# EAGLE design pc_ads1292r_shield_v2 (EAGLE 6.4)

## Sheet 1 of 2
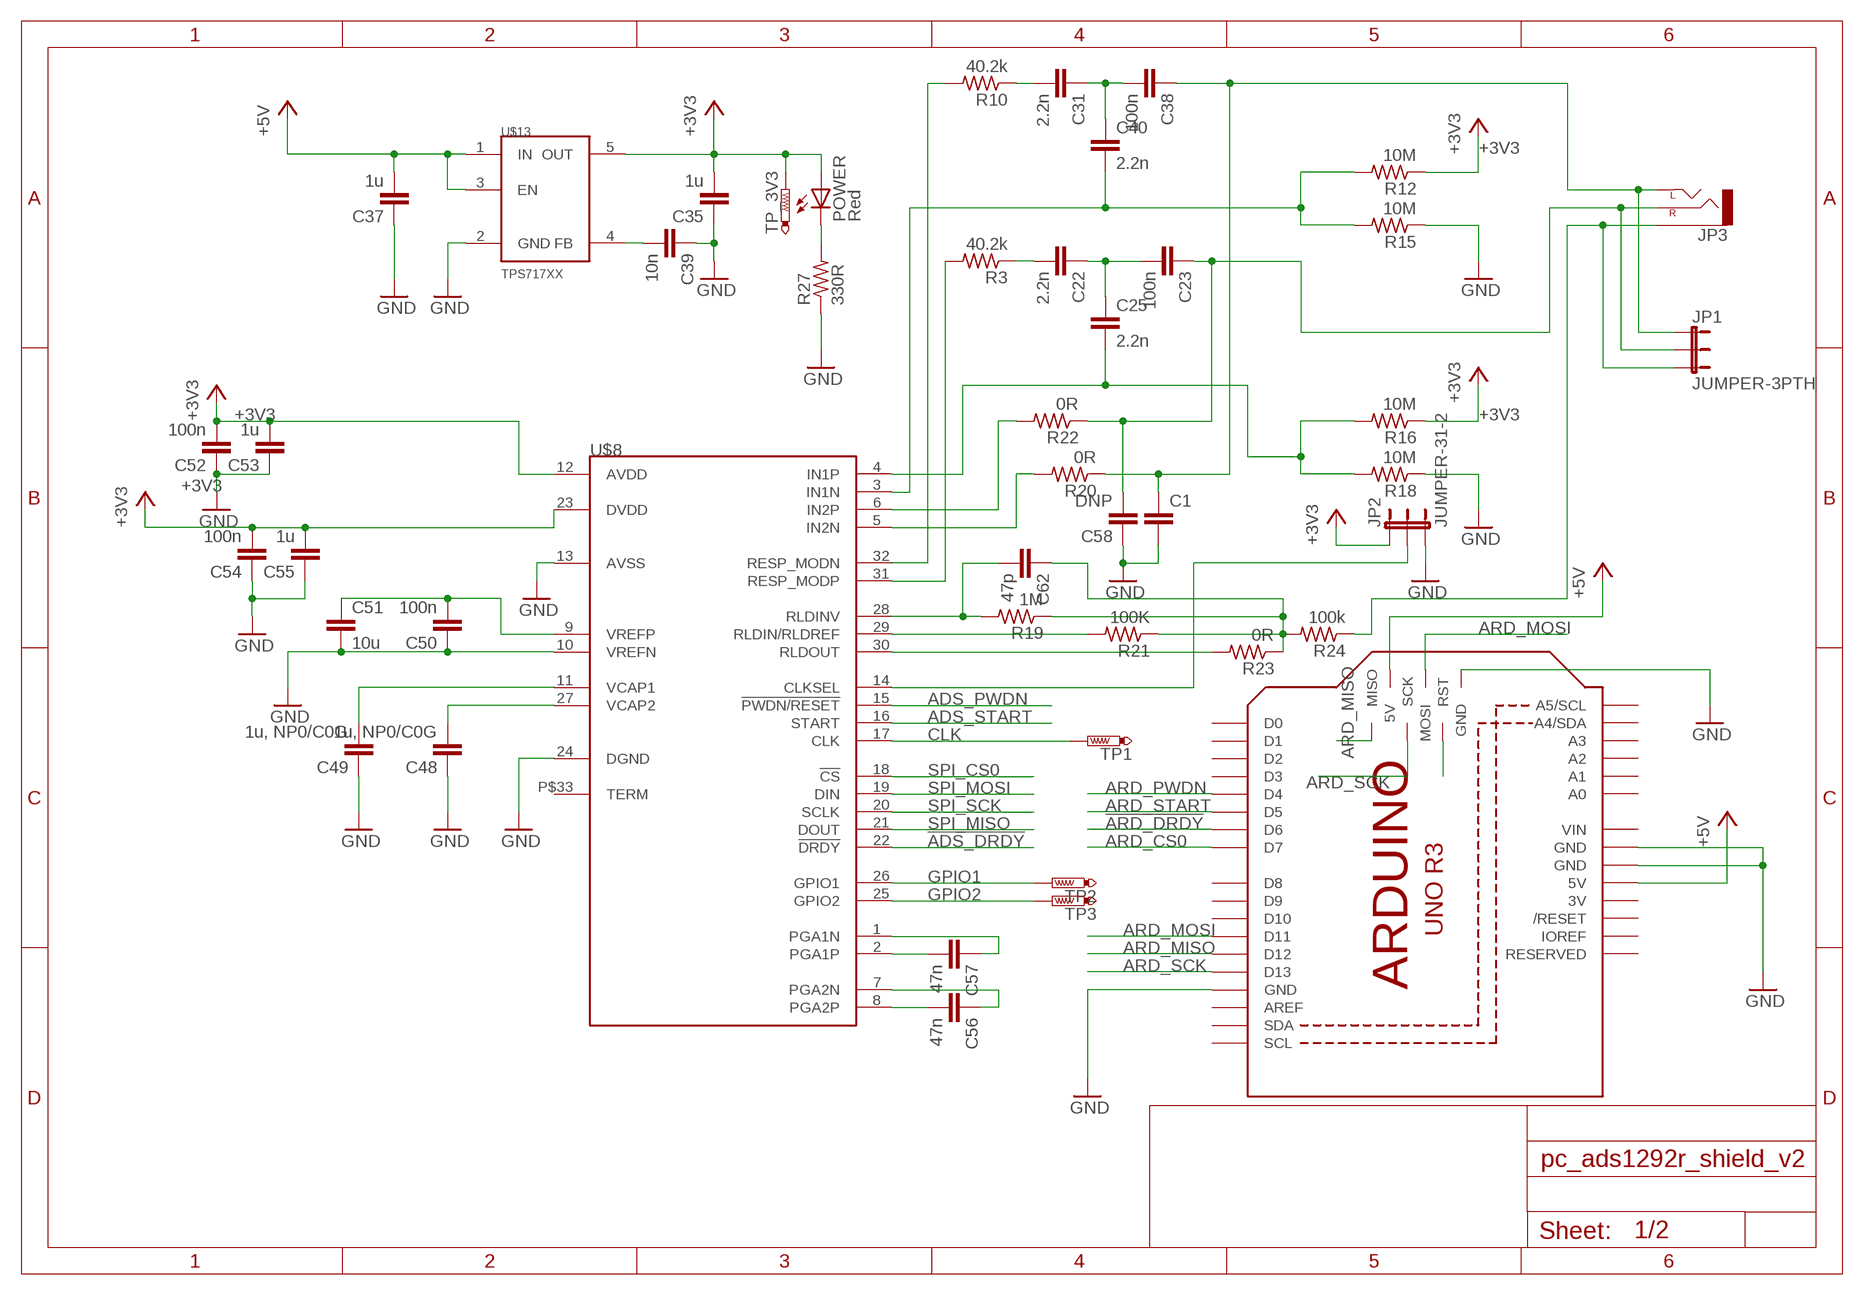
[diagram p0: schematic, sheet 1]

### Parts
C1  C-EUC0402  [C0402]
C22  2.2n  C-EUC0402  [C0402]
C23  100n  C-EUC0402  [C0402]
C25  2.2n  C-EUC0402  [C0402]
C31  2.2n  C-EUC0402  [C0402]
C35  1u  C-EUC0402  [C0402]
C37  1u  C-EUC0402  [C0402]
C38  100n  C-EUC0402  [C0402]
C39  10n  C-EUC0402  [C0402]
C40  2.2n  C-EUC0402  [C0402]
C48  1u, NP0/C0G  C-EUC0402  [C0402]
C49  1u, NP0/C0G  C-EUC0402  [C0402]
C50  100n  C-EUC0402  [C0402]
C51  10u  C-EUC0603  [C0603]
C52  100n  C-EUC0402  [C0402]
C53  1u  C-EUC0402  [C0402]
C54  100n  C-EUC0402  [C0402]
C55  1u  C-EUC0402  [C0402]
C56  47n  C-EUC0402  [C0402]
C57  47n  C-EUC0402  [C0402]
C58  DNP  C-EUC0402  [C0402]
C62  47p  C-EUC0402  [C0402]
JP1  JUMPER-3PTH  [1X03]
JP2  JUMPER-31-2  [SJ_3_PASTE1&2]
JP3  AUDIO-JACKSMD2  [AUDIO-JACK-3.5MM-SMD]
M1  ARDUINO_R3_ICSP  [ARDUINOR3_ICSP]
POWER  Red  LEDCHIPLED_0603  [CHIPLED_0603]
R3  40.2k  R-US_R0402  [R0402]
R10  40.2k  R-US_R0402  [R0402]
R12  10M  R-US_R0402  [R0402]
R15  10M  R-US_R0402  [R0402]
R16  10M  R-US_R0402  [R0402]
R18  10M  R-US_R0402  [R0402]
R19  1M  R-US_R0402  [R0402]
R20  0R  R-US_R0402  [R0402]
R21  100K  R-US_R0402  [R0402]
R22  0R  R-US_R0402  [R0402]
R23  0R  R-US_R0402  [R0402]
R24  100k  R-US_R0402  [R0402]
R27  330R  R-US_R0402  [R0402]
TP1  PTR1PAD1-17  [P1-17]
TP2  PTR1PAD1-17  [P1-17]
TP3  PTR1PAD1-17  [P1-17]
TP_3V3  PTR1PAD1-13  [P1-13]
U$8  ADS1292RPVQFN32  [S-PVQFN-N32]
U$13  TPS717XX  [SC70-5]

### Nets
!ADS_DRDY: U$8.22(!DRDY) ; also sheet 2
!ARD_DRDY: M1.D6 ; also sheet 2
+3V3: C35.2 C52.2 C53.2 C54.2 C55.2 JP2.1 POWER.A R12.1 R16.1 TP_3V3.TP U$8.12(AVDD) U$8.23(DVDD) U$13.5(OUT) ; also sheet 2
+5V: C37.2 M1.5V M1.5V_ICSP(5V) U$13.1(IN) U$13.3(EN) ; also sheet 2
ADS_PWDN: U$8.15(!PWDN/RESET) ; also sheet 2
ADS_START: U$8.16(START) ; also sheet 2
ARD_CS0: M1.D7 ; also sheet 2
ARD_MISO: M1.D12 M1.MISO ; also sheet 2
ARD_MOSI: M1.D11 M1.MOSI ; also sheet 2
ARD_PWDN: M1.D4 ; also sheet 2
ARD_SCK: M1.D13 M1.SCK ; also sheet 2
ARD_START: M1.D5 ; also sheet 2
CLK: TP1.TP U$8.17(CLK)
GND: C1.2 C35.1 C37.1 C39.1 C48.1 C49.1 C50.1 C51.2 C52.1 C53.1 C54.1 C55.1 C58.1 JP2.3 M1.GND M1.GND@1(GND) M1.GND@2(GND) M1.GND@3(GND) R15.1 R18.1 R27.1 U$8.10(VREFN) U$8.13(AVSS) U$8.24(DGND) U$13.2(GND)
GPIO1: TP2.TP U$8.26(GPIO1)
GPIO2: TP3.TP U$8.25(GPIO2)
N$1: C39.2 U$13.4(FB)
N$7: POWER.C R27.2
N$8: R3.2 U$8.31(RESP_MODP)
N$10: C22.2 R3.1
N$11: C22.1 C23.2 C25.1
N$12: R22.2 U$8.6(IN2P)
N$14: R20.2 U$8.5(IN2N)
N$19: C48.2 U$8.27(VCAP2)
N$26: R10.2 U$8.32(RESP_MODN)
N$28: C31.2 R10.1
N$29: C31.1 C38.2 C40.1
N$30: C1.1 C38.1 JP1.1 JP3.TIP(LEFT) R20.1
N$31: C40.2 R12.2 R15.2 U$8.3(IN1N)
N$32: C25.2 R16.2 R18.2 U$8.4(IN1P)
N$33: R21.2 U$8.29(RLDIN/RLDREF)
N$34: C62.2 R19.2 U$8.28(RLDINV)
N$35: C62.1 R19.1 R21.1 R23.1 R24.2
N$36: C49.2 U$8.11(VCAP1)
N$37: C56.2 U$8.8(PGA2P)
N$38: C56.1 U$8.7(PGA2N)
N$40: C50.2 C51.1 U$8.9(VREFP)
N$41: C57.2 U$8.2(PGA1P)
N$43: C57.1 U$8.1(PGA1N)
N$45: C23.1 C58.2 JP1.2 JP3.RING(RIGHT) R22.1
N$50: R23.2 U$8.30(RLDOUT)
N$51: JP1.3 JP3.SLEEVE R24.1
N$103: M1.RESET_ICSP(RST)
N$104: JP2.2 U$8.14(CLKSEL)
SPI_CS0: U$8.18(!CS) ; also sheet 2
SPI_MISO: U$8.21(DOUT) ; also sheet 2
SPI_MOSI: U$8.19(DIN) ; also sheet 2
SPI_SCK: U$8.20(SCLK) ; also sheet 2
Unconnected: M1.A0 M1.A1 M1.A2 M1.A3 M1.A4(A4/SDA) M1.A5(A5/SCL) M1.AREF M1.D0 M1.D1 M1.D2 M1.D3 M1.D8 M1.D9 M1.D10 M1.IOREF M1.RESERVED M1.RESET(/RESET) M1.SCL M1.SDA U$8.P$33(TERM)

## Sheet 2 of 2
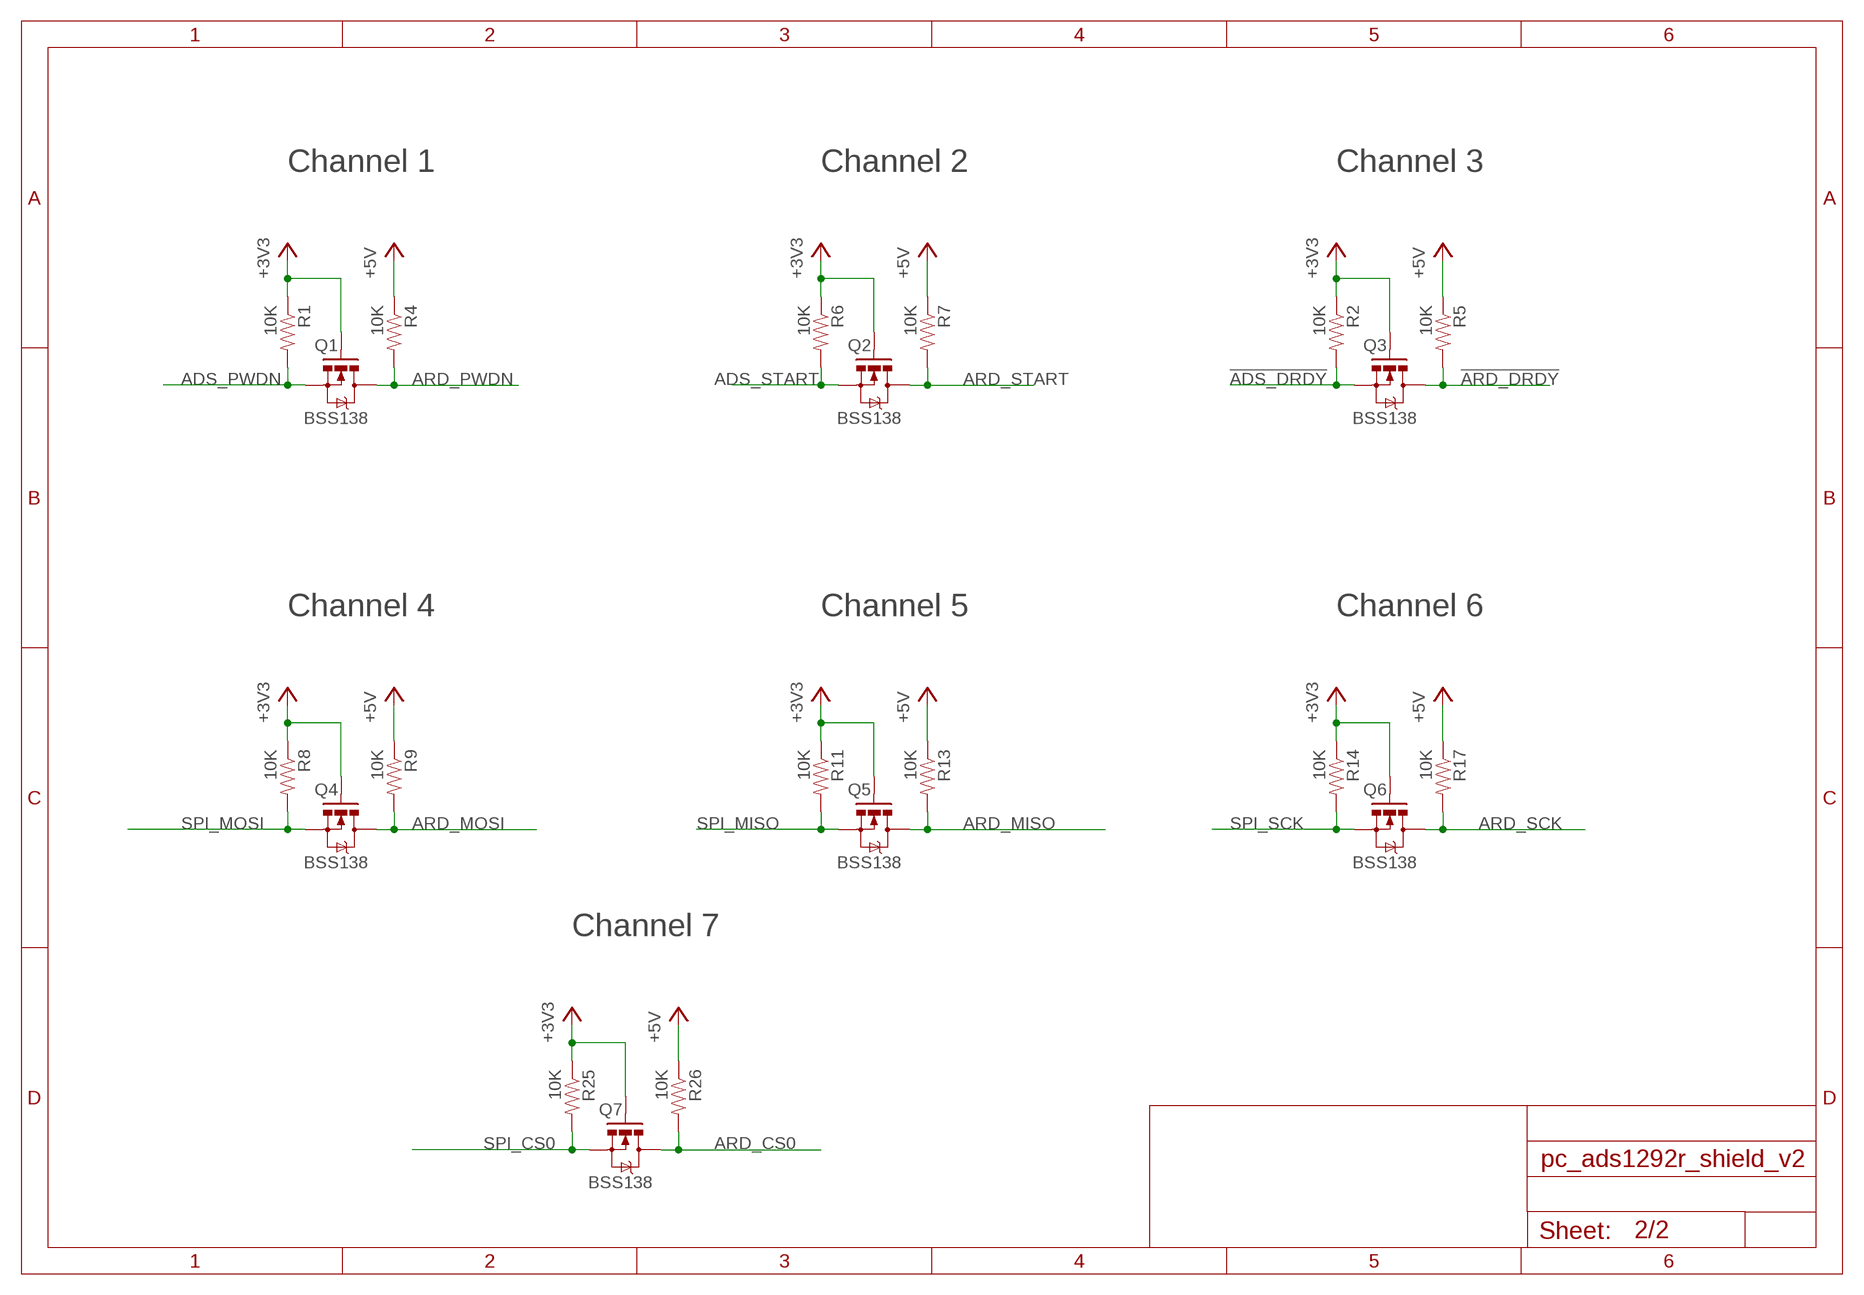
[diagram p1: schematic, sheet 2]

### Parts
Q1  BSS138  MOSFET-NCHANNELSMD  [SOT23-3]
Q2  BSS138  MOSFET-NCHANNELSMD  [SOT23-3]
Q3  BSS138  MOSFET-NCHANNELSMD  [SOT23-3]
Q4  BSS138  MOSFET-NCHANNELSMD  [SOT23-3]
Q5  BSS138  MOSFET-NCHANNELSMD  [SOT23-3]
Q6  BSS138  MOSFET-NCHANNELSMD  [SOT23-3]
Q7  BSS138  MOSFET-NCHANNELSMD  [SOT23-3]
R1  10K  RESISTOR0603-RES  [0603-RES]
R2  10K  RESISTOR0603-RES  [0603-RES]
R4  10K  RESISTOR0603-RES  [0603-RES]
R5  10K  RESISTOR0603-RES  [0603-RES]
R6  10K  RESISTOR0603-RES  [0603-RES]
R7  10K  RESISTOR0603-RES  [0603-RES]
R8  10K  RESISTOR0603-RES  [0603-RES]
R9  10K  RESISTOR0603-RES  [0603-RES]
R11  10K  RESISTOR0603-RES  [0603-RES]
R13  10K  RESISTOR0603-RES  [0603-RES]
R14  10K  RESISTOR0603-RES  [0603-RES]
R17  10K  RESISTOR0603-RES  [0603-RES]
R25  10K  RESISTOR0603-RES  [0603-RES]
R26  10K  RESISTOR0603-RES  [0603-RES]

### Nets
!ADS_DRDY: Q3.2(S) R2.2 ; also sheet 1
!ARD_DRDY: Q3.3(D) R5.2 ; also sheet 1
+3V3: Q1.1(G) Q2.1(G) Q3.1(G) Q4.1(G) Q5.1(G) Q6.1(G) Q7.1(G) R1.1 R2.1 R6.1 R8.1 R11.1 R14.1 R25.1 ; also sheet 1
+5V: R4.1 R5.1 R7.1 R9.1 R13.1 R17.1 R26.1 ; also sheet 1
ADS_PWDN: Q1.2(S) R1.2 ; also sheet 1
ADS_START: Q2.2(S) R6.2 ; also sheet 1
ARD_CS0: Q7.3(D) R26.2 ; also sheet 1
ARD_MISO: Q5.3(D) R13.2 ; also sheet 1
ARD_MOSI: Q4.3(D) R9.2 ; also sheet 1
ARD_PWDN: Q1.3(D) R4.2 ; also sheet 1
ARD_SCK: Q6.3(D) R17.2 ; also sheet 1
ARD_START: Q2.3(D) R7.2 ; also sheet 1
SPI_CS0: Q7.2(S) R25.2 ; also sheet 1
SPI_MISO: Q5.2(S) R11.2 ; also sheet 1
SPI_MOSI: Q4.2(S) R8.2 ; also sheet 1
SPI_SCK: Q6.2(S) R14.2 ; also sheet 1

### Notes on the sheet
- Channel 1 | Channel 2 | Channel 3
- Channel 4 | Channel 5 | Channel 6
- Channel 7

## Power pins joined to a net without a drawn wire
3V: M1.3V
VIN: M1.VIN

## Library data of the parts
C1 C22 C23 C25 C31 C35 C37-C40 C48-C50 C52-C58 C62 = rcl:C-EU: CAPACITOR, European symbol
C51 = resistor:C-EU: CAPACITOR, European symbol
JP1 JP2 = SparkFun:JUMPER-3
JP3 = SparkFun-Connectors:AUDIO-JACK: 3.5mm Audio Jack Simple 3.5mm common PCB mount audio jack. SKU: PRT-08032; PROD_ID: CONN-10353
M1 = adafruit:ARDUINO_R3_ICSP
POWER = led:LED: LED OSRAM: - CHIPLED LG R971, LG N971, LY N971, LG Q971, LY Q971, LO R971, LY R971 LH N974, LH R974 LS Q976, LO Q976, LY Q976 LO Q996 - Hyper CHIPLED LW Q18S LB Q993, LB Q99A, LB R99A - SideLED LS A670, LO A670, LY A670, LG A670, LP A670 LB A673, LV A673, LT A673, LW A673 LH A674 LY A675 LS A676, LA A676, LO A676, LY A676, LW A676 LS A679, LY A679, LG A679 - Hyper Micro SIDELED® LS Y876, LA Y876, LO Y876, LY Y876 LT Y87S - SmartLED LW L88C, LW L88S LB L89C, LB L89S, LG L890 LS L89K, LO L89K, LY L89K LS L896, LA L896, LO L896, LY L896 - TOPLED LS T670, LO T670, LY T670, LG T670, LP T670 LSG T670, LSP T670, LSY T670, LOP T670, LYG T670 LG T671, LOG T671, LSG T671 LB T673, LV T673, LT T673, LW T673 LH T674 LS T676, LA T676, LO T676, LY T676, LB T676, LH T676, LSB T676, LW T676 LB T67C, LV T67C, LT T67C, LS T67K, LO T67K, LY T67K, LW E67C LS E67B, LA E67B, LO E67B, LY E67B, LB E67C, LV E67C, LT E67C LW T67C LS T679, LY T679, LG T679 LS T770, LO T770, LY T770, LG T770, LP T770 LB T773, LV T773, LT T773, LW T773 LH T774 LS E675, LA E675, LY E675, LS T675 LS T776, LA T776, LO T776, LY T776, LB T776 LHGB T686 LT T68C, LB T68C - Hyper Mini TOPLED® LB M676 - Mini TOPLED Santana® LG M470 LS M47K, LO M47K, LY M47K Source: http://www.osram.convergy.de LUXEON: - LUMILED® LXK2-PW12-R00, LXK2-PW12-S00, LXK2-PW14-U00, LXK2-PW14-V00 LXK2-PM12-R00, LXK2-PM12-S00, LXK2-PM14-U00 LXK2-PE12-Q00, LXK2-PE12-R00, LXK2-PE12-S00, LXK2-PE14-T00, LXK2-PE14-U00 LXK2-PB12-K00, LXK2-PB12-L00, LXK2-PB12-M00, LXK2-PB14-N00, LXK2-PB14-P00, LXK2-PB14-Q00 LXK2-PR12-L00, LXK2-PR12-M00, LXK2-PR14-Q00, LXK2-PR14-R00 LXK2-PD12-Q00, LXK2-PD12-R00, LXK2-PD12-S00 LXK2-PH12-R00, LXK2-PH12-S00 LXK2-PL12-P00, LXK2-PL12-Q00, LXK2-PL12-R00 Source: www.luxeon.com KINGBRIGHT: KA-3528ASYC Source: www.kingbright.com
Q1-Q7 = SparkFun:MOSFET-NCHANNEL
R1 R2 R4-R9 R11 R13 R14 R17 R25 R26 = SparkFun:RESISTOR: Resistor Basic schematic elements and footprints for 0603, 1206, and PTH resistors.
R3 R10 R12 R15 R16 R18-R24 R27 = rcl:R-US_: RESISTOR, American symbol
TP1-TP3 TP_3V3 = testpad:PTR1: TEST PIN
U$8 = circuitects:ADS1292R
U$13 = circuitects:TPS717XX

## Board
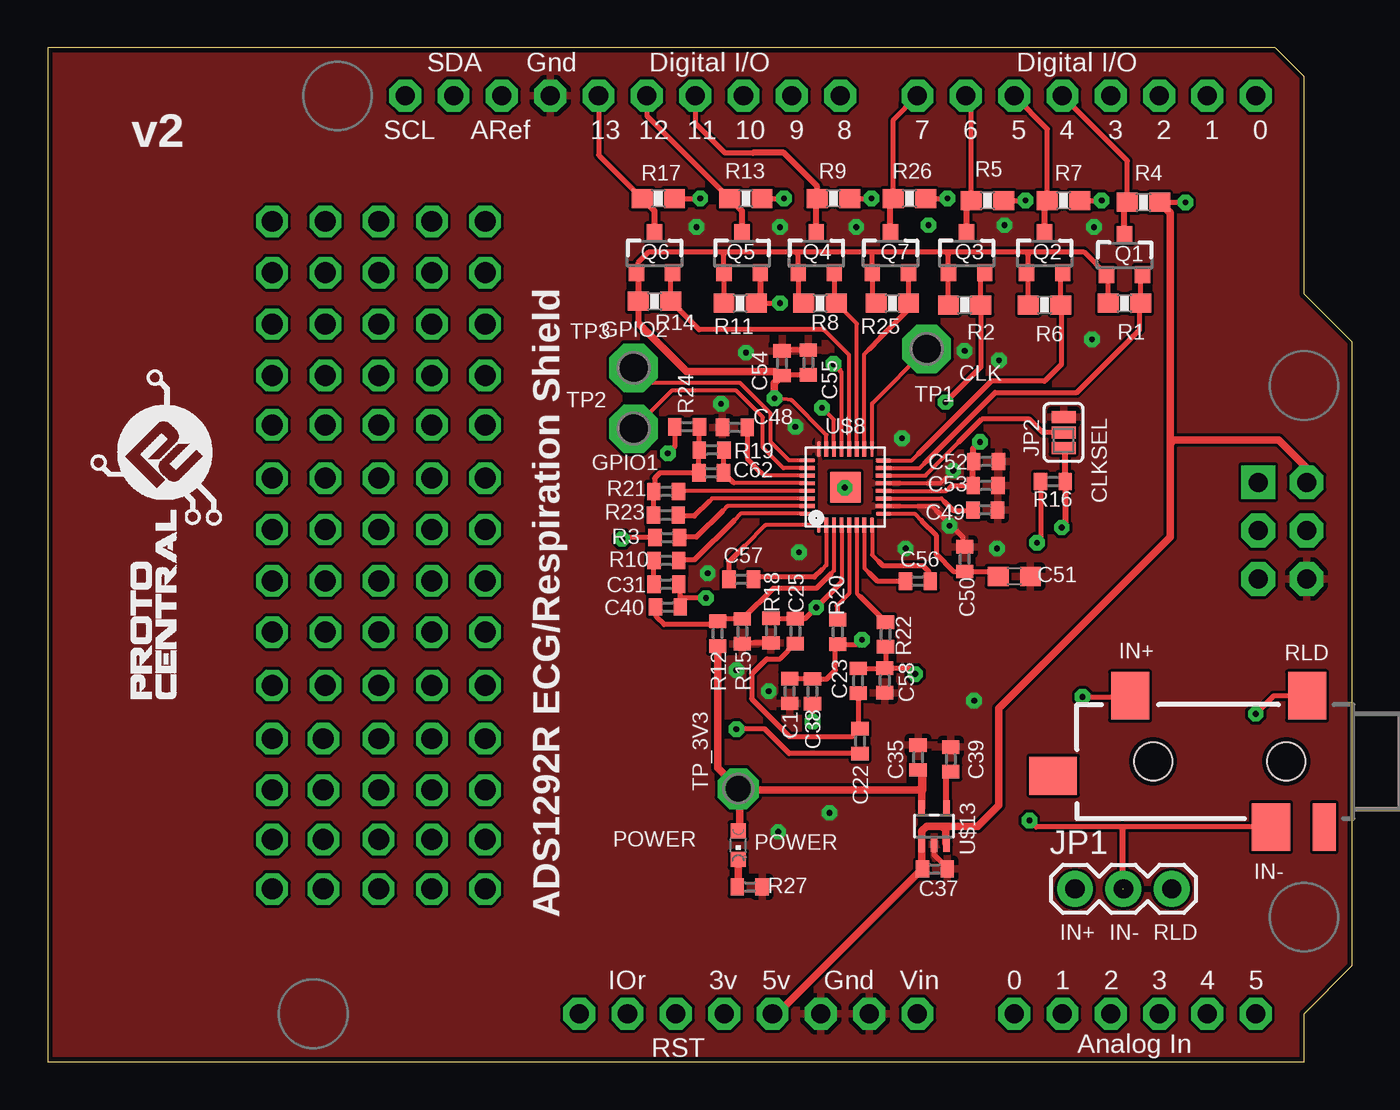
[diagram p2: board, top side]
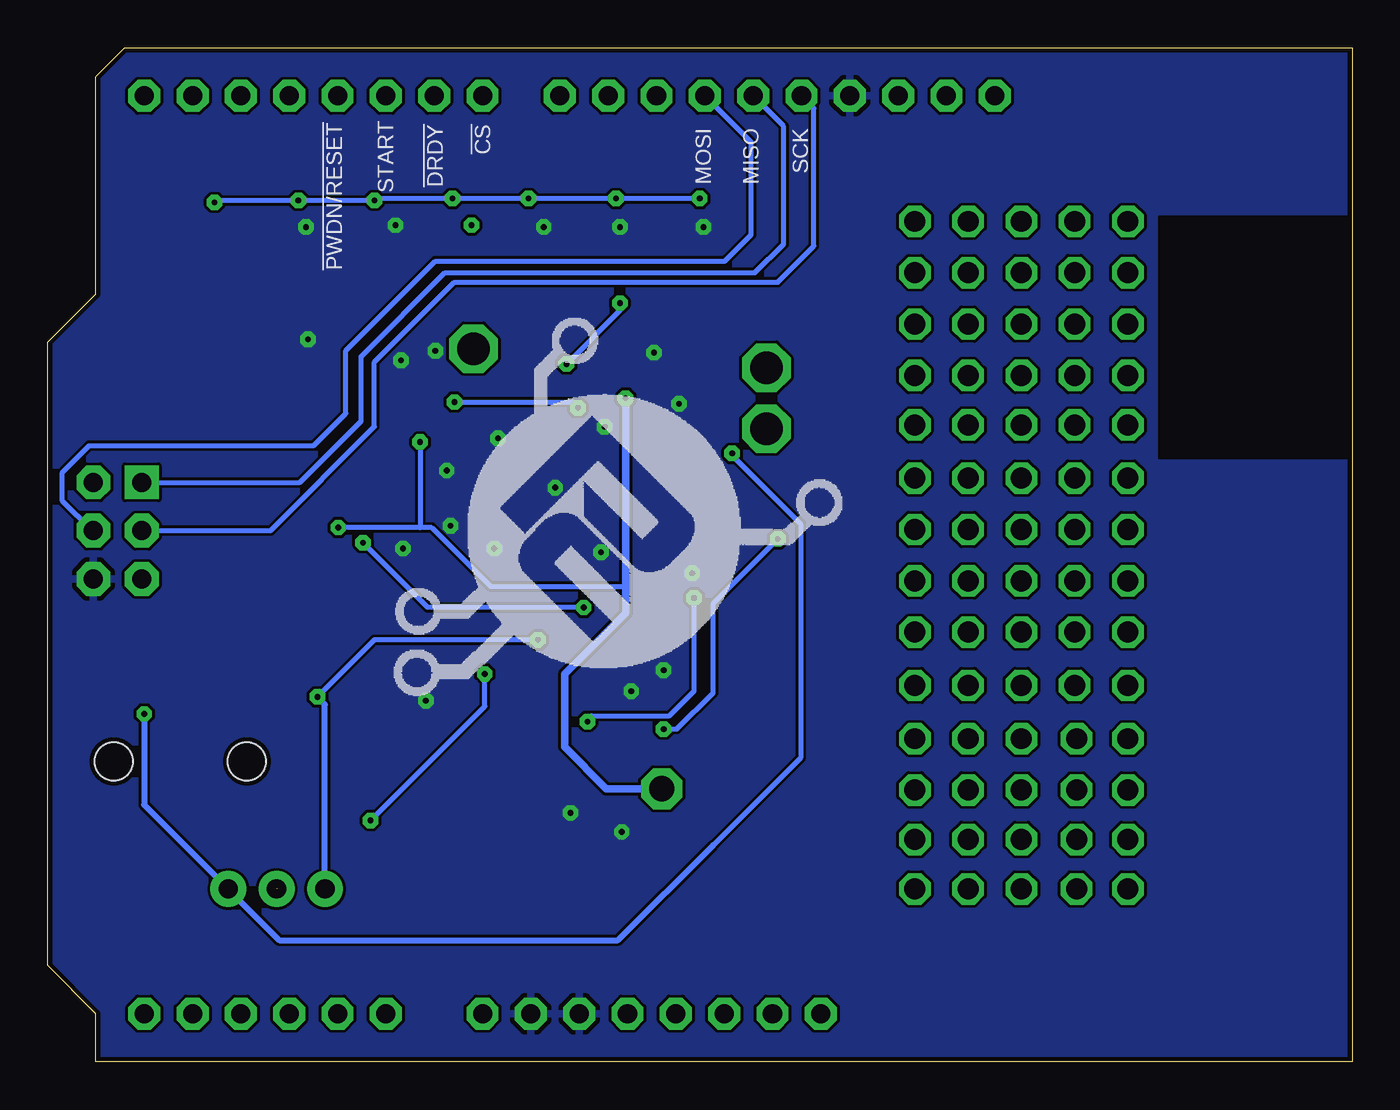
[diagram p3: board, bottom side, seen from below]

Size 68.58 x 53.34 mm. Coordinates in mm from the lower left corner, seen from the top.
Copper layers (1*2*15*16): Top 0.035mm / dielectric 1.5mm / Route2 0.035mm / dielectric 0.15mm / Route15 0.035mm / dielectric 0.2mm / Bottom 0.035mm
Design rules "Circuitects-Rules": minimum track width 6mil, minimum drill 0.3mm, track to track 6mil, track to pad 6mil, pad to pad 6mil, via to via 6mil, smd to smd 6mil, copper to edge 10mil, drill to drill 8mil, minimum pad ring 12mil, minimum via ring 10mil, stop-mask expansion 4mil, vias tented up to drill 25mil, thermal gap 10mil

### Footprints (pad centres in the part's own frame; a part is rotated, then mirrored left to right if it is on the bottom)
C0402 = smd 0.7 x 0.9: 1 -0.65,0; 2 0.65,0
C0603 = smd 1.1 x 1: 1 -0.85,0; 2 0.85,0
1X03 = drill 1.016 pad 1.88: 1 0,0; 2 2.54,0; 3 5.08,0
SJ_3_PASTE1&2 = smd 0.635 x 1.27: 1 -0.813,0; 2 0,0; 3 0.813,0
AUDIO-JACK-3.5MM-SMD = smd 2 x 2.5: RING 4.3,3.45; SLEEVE 2.4,-3.45; TIP 11.7,-3.45 | smd 1.2 x 2.5: RSH 1.5,3.45 | smd 2.5 x 2: TSH 15.75,0.75 | hole 2: 3.5,0; 10.5,0
ARDUINOR3_ICSP = drill 1 pad 1.676 octagon: 3V 35.56,2.54; 5V 38.1,2.54; A0 50.8,2.54; A1 53.34,2.54; A2 55.88,2.54; A3 58.42,2.54; A4 60.96,2.54; A5 63.5,2.54; AREF 23.876,50.8; D0 63.5,50.8; D1 60.96,50.8; D2 58.42,50.8; D3 55.88,50.8; D4 53.34,50.8; D5 50.8,50.8; D6 48.26,50.8; D7 45.72,50.8; D8 41.656,50.8; D9 39.116,50.8; D10 36.576,50.8; D11 34.036,50.8; D12 31.496,50.8; D13 28.956,50.8; GND 26.416,50.8; GND@1 43.18,2.54; GND@2 40.64,2.54; IOREF 30.48,2.54; RESERVED 27.94,2.54; RESET 33.02,2.54; SCL 18.796,50.8; SDA 21.336,50.8; VIN 45.72,2.54 | drill 1 pad 1.778 octagon: 5V_ICSP 66.167,30.48; GND@3 66.167,25.4; MOSI 66.167,27.94; RESET_ICSP 63.627,25.4; SCK 63.627,27.94 | drill 1 pad 1.778 square: MISO 63.627,30.48
CHIPLED_0603 = smd 0.8 x 0.8: A 0,-0.75; C 0,0.75
SOT23-3 = smd 0.8 x 0.9: 1 -0.95,-1; 2 0.95,-1; 3 0,1.1
0603-RES = smd 1.1 x 1: 1 -0.85,0; 2 0.85,0
R0402 = smd 0.7 x 0.9: 1 -0.65,0; 2 0.65,0
P1-17 = drill 1.702 pad 2.54 octagon: TP 0,0
P1-13 = drill 1.321 pad 2.159 octagon: TP 0,0
S-PVQFN-N32 = smd 0.8 x 0.2: 1 -2,1.4; 2 -2,1; 3 -2,0.6; 4 -2,0.2; 5 -2,-0.2; 6 -2,-0.6; 7 -2,-1; 8 -2,-1.4; 17 2,-1.4; 18 2,-1; 19 2,-0.6; 20 2,-0.2; 21 2,0.2; 22 2,0.6; 23 2,1; 24 2,1.4 | smd 0.2 x 0.8: 9 -1.4,-2; 10 -1,-2; 11 -0.6,-2; 12 -0.2,-2; 13 0.2,-2; 14 0.6,-2; 15 1,-2; 16 1.4,-2; 25 1.4,2; 26 1,2; 27 0.6,2; 28 0.2,2; 29 -0.2,2; 30 -0.6,2; 31 -1,2; 32 -1.4,2 | smd 1.6 x 1.6: P$33 0,0
SC70-5 = smd 0.35 x 0.8: 1 -0.65,-0.95; 2 0,-0.95; 3 0.65,-0.95; 4 0.65,0.95; 5 -0.65,0.95

### Placement (x,y rotation side)
C1  39,19.5 270 top
C22  42.7,16.87 270 top
C23  42.6,20.04 270 top
C25  39.3,22.65 90 top
C31  32.52,25.12 180 top
C35  45.75,16.01 270 top
C37  46.63,10.15 180 top
C38  40.2,19.49 270 top
C39  47.47,15.91 270 top
C40  32.6,23.92 180 top
C48  36.12,33.37 0 top
C49  49.28,29.03 180 top
C50  48.2,26.44 270 top
C51  50.81,25.54 0 top
C52  49.33,31.58 180 top
C53  49.3,30.32 180 top
C54  38.6,36.74 270 top
C55  39.98,36.78 270 top
C56  45.74,25.28 0 top
C57  36.46,25.38 0 top
C58  44,20.06 90 top
C62  34.88,30.98 0 top
JP1  54,9.1 0 top
JP2  53.4,33.1 90 top
JP3  68.6,15.8 180 top
M1  0,0 0 top
POWER  36.3,11.4 180 top
Q1  56.6,42.4 0 top
Q2  52.4,42.5 0 top
Q3  48.3,42.5 0 top
Q4  40.4,42.5 0 top
Q5  36.5,42.5 0 top
Q6  31.9,42.5 0 top
Q7  44.3,42.5 0 top
R1  56.6,39.9 0 top
R2  48.2,39.8 0 top
R3  32.57,27.57 0 top
R4  57.6,45.2 180 top
R5  49.4,45.3 180 top
R6  52.4,39.8 0 top
R7  53.4,45.3 180 top
R8  40.6,39.9 0 top
R9  41.3,45.4 180 top
R10  32.52,26.37 0 top
R11  36.4,39.9 0 top
R12  35.22,22.52 90 top
R13  36.7,45.4 180 top
R14  31.9,40 0 top
R15  36.52,22.64 90 top
R16  52.84,30.52 180 top
R17  32.1,45.4 180 top
R18  38.02,22.68 90 top
R19  34.9,32.18 0 top
R20  41.53,22.61 90 top
R21  32.51,30 0 top
R22  44.04,22.48 90 top
R23  32.5,28.76 0 top
R24  33.61,33.4 0 top
R25  44.4,39.9 0 top
R26  45.3,45.4 180 top
R27  36.9,9.2 180 top
TP1  46.2,37.5 0 top
TP2  30.8,33.3 0 top
TP3  30.8,36.5 0 top
TP_3V3  36.3,14.37 90 top
U$1  [PROTY_WITH_TEXT]  9.2,18 90 top
U$2  [PROTY-LOGO-LARGE]  50.6,18.9 0 bottom
U$8  41.93,30.23 90 top
U$13  46.59,12.4 0 top

### Tracks (layer width: path | path; a pad name or v marks a point on that pad's centre or on a via)
!ADS_DRDY  (via drill 0.3)
  Top 0.2: U$8.22 41.33,33.77 v40.7,34.4
  Top 0.254: Q3.2 49.05,41.3 R2.2 49.05,36.55 v47.2,34.7
  Bottom 0.254: v47.2,34.7 41,34.7 v40.7,34.4
!ARD_DRDY
  Top 0.254: R5.2 48.55,50.54 48.52,50.54 M1.D6
  Top 0.305: Q3.3 48.3,45.25 R5.2
+3V3  (via drill 0.3)
  Top 0.152: C35.2 45.94,15.36 46,15.3 | C54.2 38.5,36.1 38.3,36.3
  Top 0.2: U$8.23 40.93,32.97 39.1,34.8 v38.2,34.9 | U$8.12 47.23,30.03 47.5,30.3
  Top 0.254: C55.2 38.64,36.13 C54.2 | R2.1 Q3.1 47.35,42.45 47.2,42.6 | Q6.1 31.05,41.4 31.05,42.05 31.6,42.6 35.4,42.6 | R6.1 51.55,41.4 | 51.55,41.4 Q2.1 | R1.1 55.75,41.3 Q1.1 54.45,42.6 51.4,42.6 | R8.1 39.45,40.2 Q4.1 39.45,42.45 39.3,42.6 | 35.4,42.6 39.3,42.6 | 39.3,42.6 43.4,42.6 | 43.4,42.6 47.2,42.6 | 47.2,42.6 51.4,42.6 | 51.55,41.4 51.55,42.45 51.4,42.6 | 43.4,42.6 43.35,42.55 Q7.1 43.35,40.1 R25.1 | 35.4,42.6 35.55,42.45 Q5.1 R11.1 | v53.29,28.11 v53.3,28.1 | 47.5,30.3 48.63,30.3 C53.2 | 48.65,31.55 C52.2
  Top 0.305: 31.05,38.85 R14.1 31.05,41.4 | C54.2 | 48.65,31.55 48.65,32.25 v49,32.6 | 48.63,30.3 48.63,31.53 C52.2 | JP2.1 53.49,32.2 R16.1 53.49,28.29 v53.3,28.1
  Top 0.406: U$13.5 45.94,15.17 C35.2 | R12.1 35.22,15.45 TP_3V3.TP 36.37,14.3 | v38.2,34.9 38.2,35.69 C54.2 | 46,15.3 46,14.3 36.37,14.3 | 38.3,36.3 33.6,36.3 31.05,38.85 | 36.37,14.3 36.37,12.22 POWER.A
  Bottom 0.254: 38.2,25.1 38.3,25 45.3,25 48.4,28.1 49,28.1 | 49,28.1 v53.3,28.1 | v49,32.6 49,28.1
  Bottom 0.406: v38.2,34.9 38.2,25.1 38.2,23.6 41.4,20.4 41.4,16.56 39.21,14.37 TP_3V3.TP
+5V  (via drill 0.3)
  Top 0.254: R17.1 v34.3,45.4 | R13.1 v38.7,45.4 | R9.1 v43.3,45.4 | R26.1 v47.3,45.4 | R5.1 v51.4,45.3 | R7.1 v55.4,45.3 | R4.1 v59.8,45.2
  Top 0.406: 47,12.4 46.2,12.4 45.94,12.14 U$13.1 45.94,10.19 C37.2 38.36,2.53 M1.5V | 47,12.4 47.2,12.2 47.2,11.49 U$13.3 | 58.9,44.75 R4.1 59,44.65 59,32.5 | 47,12.4 48.9,12.4 50,13.5 50,18.6 59,27.6 59,32.5 | M1.5V_ICSP 66.17,31.23 64.7,32.7 59.2,32.7 59,32.5
  Bottom 0.254: v34.3,45.4 v38.7,45.4 v43.3,45.4 v47.3,45.4 51.3,45.4 v51.4,45.3 v55.4,45.3 59.7,45.3 v59.8,45.2
ADS_PWDN
  Top 0.2: U$8.15 45.83,31.23 46.2,31.6
  Top 0.254: Q1.2 57.45,41.3 R1.2 57.4,39.85 57.4,38.5 54.1,35.2 49.8,35.2 46.2,31.6 46.08,31.48
ADS_START
  Top 0.2: U$8.16 45.43,31.63 45.78,31.98
  Top 0.254: Q2.2 53.25,41.4 R6.2 53.3,39.75 53.3,36.7 52.4,35.8 49.6,35.8 45.78,31.98
ARD_CS0
  Top 0.254: R26.2 44.45,49.53 M1.D7
  Top 0.305: Q7.3 44.3,45.25 R26.2
ARD_MISO
  Top 0.254: R13.2 31.5,49.75 M1.D12
  Top 0.305: Q5.3 36.5,44.75 R13.2
  Bottom 0.254: M1.MISO 55.32,30.48 52.1,33.7 52.1,37.1 47.7,41.5 31.4,41.5 29.9,43 29.9,49.2 M1.D12
ARD_MOSI
  Top 0.254: M1.D11 34.04,49.36 35.6,47.8 37.07,47.8
  Top 0.305: Q4.3 40.4,45.35 R9.2 40.45,46.05 38.7,47.8 37.07,47.8
  Bottom 0.254: M1.D11 31.6,48.36 31.6,43.5 33,42.1 48.2,42.1 52.9,37.4 52.9,34.1 54.25,32.75 54.6,32.4 66.4,32.4 67.8,31 67.8,29.5 66.24,27.94 M1.MOSI
ARD_PWDN
  Top 0.254: R4.2 56.75,47.39 M1.D4
  Top 0.305: Q1.3 56.6,45.05 R4.2
ARD_SCK
  Top 0.254: R17.2 29.12,47.52 29,47.65 28.96,47.69 M1.D13
  Top 0.305: Q6.3 31.9,44.75 R17.2
  Bottom 0.254: M1.SCK 56.86,27.94 51.4,33.4 51.4,36.8 47.2,41 30.2,41 28.3,42.9 28.3,50.14 M1.D13
ARD_START
  Top 0.254: R7.2 52.55,49.05 M1.D5
  Top 0.305: Q2.3 52.4,45.15 R7.2
CLK
  Top 0.2: U$8.17 43.33,34.63 TP1.TP
GND  (via drill 0.3)
  Top 0.2: U$8.10 46.47,29.23 46.72,28.98 | U$8.13 46.93,30.43 v47.6,31.1
  Top 0.254: R18.1 36.56,22.03 R15.1 | 46.72,28.98 48.1,27.6 48.1,27.19 C50.1 | C37.1 47.28,10.22 46.6,10.9 U$13.2 | C55.1 38.64,37.43 C54.1
  other vias: 48.2,37.4 48.7,19 38.4,12.1 39.3,33.4 44.9,32.8 37.9,19.5 36.2,20.6 36.7,37.3 34.7,25.7 45.1,27 50,36.9 54.9,38 55,43.9 50.3,44 42.5,43.9 38.5,43.9 34.1,43.9 41.1,13.1 41.9,30.2 39.5,26.8 47.4,28.2 49.9,27 35.4,34.6
  pour Top: -0.6,54 69.4,53.9 69.4,-0.5 -0.6,-0.4
  pour Bottom: -0.6,53.9 69.3,53.7 69.3,-1 -0.1,-1
GPIO1
  Top 0.2: U$8.26 38.67,31.23 37.6,32.3 37.6,33.9 36.2,35.3 32.8,35.3 TP2.TP
GPIO2
  Top 0.2: U$8.25 38.97,31.63 38,32.6 38,34.1 36.4,35.7 31.6,35.7 TP3.TP
N$1
  Top 0.305: U$13.4 47.24,15.03 C39.2
N$2  (via drill 1.1)
  other vias: 14.6,41.5
N$3  (via drill 1.1)
  other vias: 14.6,38.8
N$4  (via drill 1.1)
  other vias: 14.6,36.1
N$5  (via drill 1.1)
  other vias: 14.6,33.5
N$6  (via drill 1.1)
  other vias: 14.6,30.7
N$7
  Top 0.406: POWER.C 36.3,9.25 R27.2
N$8
  Top 0.2: U$8.31 35.73,29.23 35.48,28.98
  Top 0.254: 35.48,28.98 34.1,27.6 33.25,27.6 R3.2
N$9  (via drill 1.1)
  other vias: 14.6,28
N$10  (via drill 0.3)
  Top 0.254: v36.2,17.5 37.7,17.5 38.98,16.22 C22.2 | R3.1 30.27,27.57 v30.2,27.5
  Bottom 0.254: v36.2,17.5 35.5,17.5 33.6,19.4 33.6,24.1 v30.2,27.5
N$11
  Top 0.254: C23.2 42.6,17.62 C22.1 42.28,17.1 39,17.1 37,19.1 37,20.4 37.8,21.2 38.5,21.2 C25.1
N$12
  Top 0.2: U$8.6 42.53,24.64 42.84,24.34
  Top 0.254: 42.68,24.49 42.84,24.34 R22.2
N$13  (via drill 1.1)
  other vias: 14.6,25.3
N$14
  Top 0.2: U$8.5 42.13,24.63 41.5,24
  Top 0.254: 41.5,24 41.5,23.29 R20.2
N$15  (via drill 1.1)
  other vias: 14.6,22.6
N$16  (via drill 1.1)
  other vias: 14.6,19.8
N$17  (via drill 1.1)
  other vias: 14.5,17
N$19
  Top 0.2: U$8.27 37.67,30.83 37.52,30.98
  Top 0.254: 37.52,30.98 36.8,31.7 36.8,33.54 C48.2
N$20  (via drill 1.1)
  other vias: 23,30.7
N$22  (via drill 1.1)
  other vias: 17.4,17
N$23  (via drill 1.1)
  other vias: 17.4,19.8
N$24  (via drill 1.1)
  other vias: 17.4,22.6
N$25  (via drill 1.1)
  other vias: 17.4,28
N$26
  Top 0.2: U$8.32 36.43,28.83 36.08,28.48
  Top 0.254: 36.08,28.48 34,26.4 33.2,26.4 R10.2
N$27  (via drill 1.1)
  other vias: 17.4,25.3
N$28
  Top 0.254: C31.2 R10.1
N$29  (via drill 0.3)
  Top 0.254: C40.1 33.25,24.5 | 33.25,24.5 33.25,25.04 C31.1 | C38.2 v40.2,17.9 | v34.6,24.4 33.35,24.4 33.25,24.5
  Bottom 0.254: v40.2,17.9 40.2,18 40,18.2 35.9,18.2 34.6,19.5 v34.6,24.4
N$30  (via drill 0.3)
  Top 0.254: C1.1 C38.1 40.94,20.14 41.4,20.6 41.4,21.83 R20.1 42.56,21.96 v42.8,22.2 | v54.4,19.2 56.85,19.2 JP3.TIP
  Bottom 0.254: v42.8,22.2 51.4,22.2 v54.4,19.2
  Bottom 0.305: JP1.1 54,18.8 v54.4,19.2
N$31
  Top 0.2: U$8.3 41.33,25.83 41.18,25.68
  Top 0.254: 41.18,25.68 40.4,24.9 38.13,24.9 R15.2 35.3,23.29 R12.2 35.17,23.37 34.8,23 32.4,23 32,23.4 32,23.87 C40.2
N$32  (via drill 0.3)
  Top 0.2: U$8.4 41.73,25.43
  Top 0.254: R18.2 39.57,23.33 | 39.57,23.33 C25.2 | 41.73,25.43 41.73,25.23 v40.4,23.9 39.83,23.33 39.57,23.33 | R16.2 52.19,27.49 v52,27.3
  Bottom 0.254: v40.4,23.9 48.6,23.9 v52,27.3
N$33
  Top 0.2: U$8.29 33.19,30.03 R21.2
  Top 0.254: 33.18,29.98 R21.2
N$34
  Top 0.2: U$8.28 36.08,30.43 36.03,30.48
  Top 0.254: R19.2 35.53,32.26 C62.2 36.03,30.48
N$35
  Top 0.254: R24.2 34.25,33.49 R19.1 34.23,32.26 C62.1 32.18,30.98 31.9,30.7 31.9,30.04 R21.1 R23.1
N$36
  Top 0.2: U$8.11 46.97,29.63 47.12,29.48
  Top 0.254: 47.12,29.48 47.6,29 48.6,29 C49.2
N$37
  Top 0.2: U$8.8 43.33,26.67 43.68,26.32
  Top 0.254: 43.68,26.32 43.9,26.1 46,26.1 46.3,25.8 46.3,25.37 C56.2
N$38
  Top 0.2: U$8.7 42.93,25.97 43.18,25.72
  Top 0.254: 43.18,25.72 43.6,25.3 45.07,25.3 C56.1
N$39  (via drill 1.1)
  other vias: 23,44.2
N$40
  Top 0.2: U$8.9 45.57,28.83 45.92,28.48
  Top 0.254: 45.92,28.48 46.7,27.7 46.7,26.7 47.6,25.8 C50.2 49.91,25.79 C51.1
N$41
  Top 0.2: U$8.2 40.93,26.13 40.68,25.88
  Top 0.254: 40.68,25.88 40.3,25.5 37.23,25.5 C57.2
N$42  (via drill 1.1)
  other vias: 17.4,30.7
N$43
  Top 0.2: U$8.1 37.73,28.23 36.63,27.13
  Top 0.254: 36.63,27.13 35.8,26.3 C57.1
N$44  (via drill 1.1)
  other vias: 17.4,33.5
N$45  (via drill 0.3)  (1 unrouted)
  Top 0.254: C23.1 43.98,20.69 C58.2 | R22.1 44.04,20.75 C58.2 | JP3.RING 56.5,12.35 51.95,12.35 v51.6,12.7 | C58.2 45.29,20.71 v45.6,20.4
  Top 0.305: 56.5,9.1 56.5,12.35
  Bottom 0.254: v51.6,12.7 45.6,18.7 v45.6,20.4
N$46  (via drill 1.1)
  other vias: 17.4,36.1
N$47  (via drill 1.1)
  other vias: 17.4,38.8
N$48  (via drill 1.1)
  other vias: 17.4,41.5
N$49  (via drill 1.1)
  other vias: 20.2,17
N$50
  Top 0.2: U$8.30 34.93,29.63 34.78,29.48
  Top 0.254: 34.78,29.48 34,28.7 33.21,28.7 R23.2
N$51  (via drill 0.3)
  Top 0.254: R24.1 32.96,32.36 v32.6,32 | JP3.SLEEVE 64.45,19.25 v63.5,18.3
  Bottom 0.254: v32.6,32 32.6,31.9 29,28.3 29,16 33.6,11.4
  Bottom 0.305: v63.5,18.3 63.5,13.52 JP1.3 59.08,9.08 56.4,6.4 38.6,6.4 33.6,11.4
N$52  (via drill 1.1)
  other vias: 20.2,19.8
N$53  (via drill 1.1)
  other vias: 20.2,22.6
N$54  (via drill 1.1)
  other vias: 20.2,25.3
N$55  (via drill 1.1)
  other vias: 20.2,28
N$56  (via drill 1.1)
  other vias: 20.2,30.7
N$57  (via drill 1.1)
  other vias: 20.2,33.5
N$58  (via drill 1.1)
  other vias: 20.2,36.1
N$59  (via drill 1.1)
  other vias: 20.2,38.8
N$60  (via drill 1.1)
  other vias: 20.2,41.5
N$61  (via drill 1.1)
  other vias: 11.8,19.8
N$62  (via drill 1.1)
  other vias: 11.8,22.6
N$63  (via drill 1.1)
  other vias: 11.8,25.3
N$64  (via drill 1.1)
  other vias: 11.8,28
N$65  (via drill 1.1)
  other vias: 11.8,30.7
N$66  (via drill 1.1)
  other vias: 11.8,33.5
N$67  (via drill 1.1)
  other vias: 11.8,36.1
N$68  (via drill 1.1)
  other vias: 11.8,38.8
N$69  (via drill 1.1)
  other vias: 11.8,41.5
N$70  (via drill 1.1)
  other vias: 11.8,44.2
N$71  (via drill 1.1)
  other vias: 11.8,17
N$72  (via drill 1.1)
  other vias: 23,33.5
N$73  (via drill 1.1)
  other vias: 23,38.8
N$77  (via drill 1.1)
  other vias: 23,36.1
N$78  (via drill 1.1)
  other vias: 23,41.5
N$79  (via drill 1.1)
  other vias: 14.6,44.2
N$80  (via drill 1.1)
  other vias: 17.4,44.2
N$81  (via drill 1.1)
  other vias: 20.2,44.2
N$82  (via drill 1.1)
  other vias: 23,28
N$83  (via drill 1.1)
  other vias: 23,25.3
N$84  (via drill 1.1)
  other vias: 23,22.6
N$85  (via drill 1.1)
  other vias: 23,19.8
N$86  (via drill 1.1)
  other vias: 23,17
N$87  (via drill 1.1)
  other vias: 11.8,14.3
N$88  (via drill 1.1)
  other vias: 14.5,14.3
N$89  (via drill 1.1)
  other vias: 17.4,14.3
N$90  (via drill 1.1)
  other vias: 20.2,14.3
N$91  (via drill 1.1)
  other vias: 23,14.3
N$92  (via drill 1.1)
  other vias: 11.8,11.7
N$93  (via drill 1.1)
  other vias: 14.5,11.7
N$94  (via drill 1.1)
  other vias: 17.4,11.7
N$95  (via drill 1.1)
  other vias: 20.2,11.7
N$96  (via drill 1.1)
  other vias: 23,11.7
N$97  (via drill 1.1)
  other vias: 11.8,9.1
N$98  (via drill 1.1)
  other vias: 14.5,9.1
N$99  (via drill 1.1)
  other vias: 17.4,9.1
N$100  (via drill 1.1)
  other vias: 20.2,9.1
N$101  (via drill 1.1)
  other vias: 23,9.1
N$104
  Top 0.2: U$8.14 46.13,30.83 47.9,32.6
  Top 0.254: 47.9,32.6 49.1,33.8 51.6,33.8 52.3,33.1 JP2.2
N$107  (via drill 0.3)
  other vias: 46.3,44
SPI_CS0
  Top 0.2: U$8.18 42.93,37.23 43.75,38.05
  Top 0.254: Q7.2 R25.2 45.3,39.85 45.3,39.6 43.75,38.05 43.18,37.48
SPI_MISO  (via drill 0.3)
  Top 0.2: U$8.21 41.73,36.27 41.68,36.32
  Top 0.254: 41.68,36.32 v41.3,36.7 | R11.2 v38.5,39.9
  Top 0.305: Q5.2 37.45,40.1 R11.2
  Bottom 0.254: v38.5,39.9 38.5,39.5 v41.3,36.7
SPI_MOSI
  Top 0.2: U$8.19 42.53,38.82 R8.2
  Top 0.254: 41.3,39.85 R8.2 41.35,40 Q4.2
SPI_SCK
  Top 0.2: U$8.20 42.13,37.17 40.8,38.5
  Top 0.254: Q6.2 32.75,41.4 R14.2 34.25,38.5 40.8,38.5

### Text on the board
tPlace: v2 | GPIO2 | CLK | GPIO1 | CLKSEL | IN+ | RLD | POWER | IN- | ADS1292R ECG/Respiration Shield | IN+ | IN- | RLD
bPlace: START | SCK | MISO | MOSI | !CS | !DRDY | !PWDN/RESET